# EAGLE design Character ID Receiver I2C xbee (EAGLE 6.4)
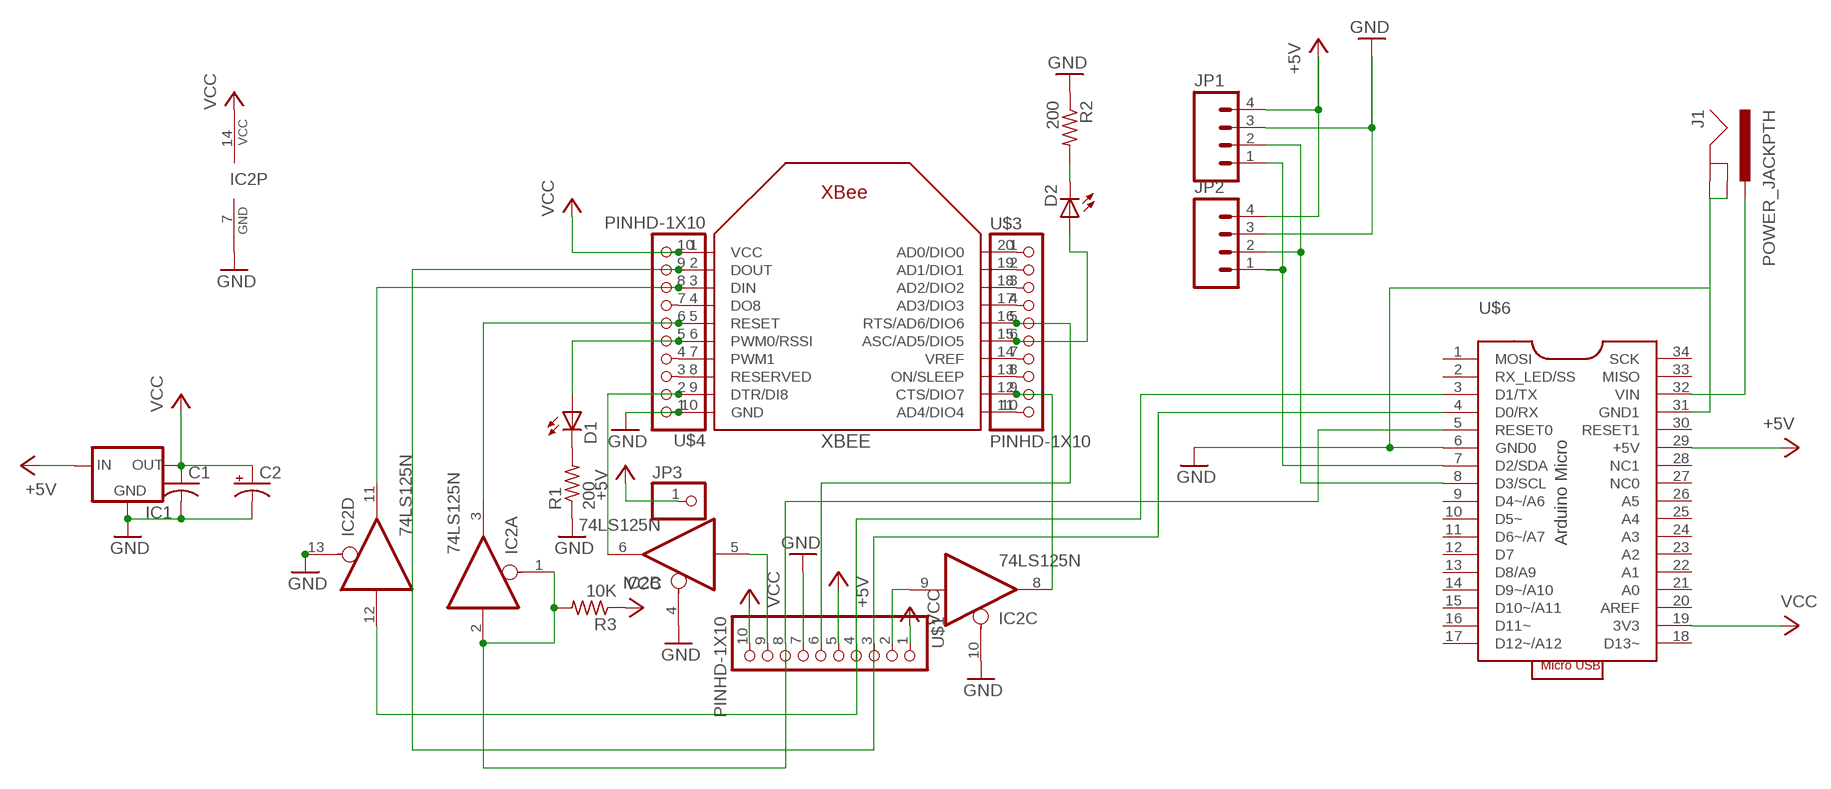
[diagram p0: schematic, sheet 1]

## Parts
C1  C-US025-025X050  [C025-025X050]
C2  CPOL-USE2.5-5  [E2,5-5]
D1  LED3MM  [LED3MM]
D2  LED3MM  [LED3MM]
IC1  MC1700  [TO92]
IC2  74LS125N  [DIL14]
J1  POWER_JACKPTH  [POWER_JACK_PTH]
JP1  M041X04_NO_SILK  [1X04_NO_SILK]
JP2  M041X04_NO_SILK  [1X04_NO_SILK]
JP3  PINHD-1X1  [1X01]
R1  200  R-US_0207/10  [0207/10]
R2  200  R-US_0207/10  [0207/10]
R3  10K  R-US_0207/10  [0207/10]
U$1  PINHD-1X10  [1X10-BIG]
U$3  PINHD-1X10  [1X10-BIG]
U$4  PINHD-1X10  [1X10-BIG]
U$6  ARDUINO-MICRO  [ARDUINO-MICRO-DIP34]
XBEE  XBEE  [XBEE]

## Nets
+5V: IC1.2(IN) JP1.4 JP2.4 JP3.1 U$1.5 U$6.29(+5V)
GND: C1.2 C2.- IC1.1(GND) IC2.4(B:OE) IC2.7(P:GND) IC2.10(C:OE) IC2.13(D:OE) J1.GND J1.GNDBREAK JP1.3 JP2.3 R1.1 R2.1 U$1.7 U$4.1 U$6.6(GND0) U$6.31(GND1) XBEE.10(GND)
N$1: IC2.12(D:I) U$1.4 U$6.3(D1/TX)
N$2: IC2.11(D:O) U$4.8 XBEE.3(DIN)
N$3: IC2.5(B:I) U$1.9
N$4: IC2.8(C:O) U$3.9 XBEE.12(CTS/DIO7)
N$5: D2.K(C) R2.2
N$6: U$4.7 XBEE.4(DO8)
N$7: D1.A U$4.5 XBEE.6(PWM0/RSSI)
N$8: D1.K(C) R1.2
N$9: D2.A U$3.6 XBEE.15(ASC/AD5/DIO5)
N$10: IC2.6(B:O) U$4.2 XBEE.9(DTR/DI8)
N$11: U$4.3 XBEE.8(RESERVED)
N$12: U$4.4 XBEE.7(PWM1)
N$13: IC2.3(A:O) U$4.6 XBEE.5(RESET)
N$14: U$3.1 XBEE.20(AD0/DIO0)
N$15: U$3.2 XBEE.19(AD1/DIO1)
N$16: U$3.3 XBEE.18(AD2/DIO2)
N$17: U$3.4 XBEE.17(AD3/DIO3)
N$18: U$3.7 XBEE.14(VREF)
N$19: U$3.8 XBEE.13(ON/SLEEP)
N$20: U$3.10 XBEE.11(AD4/DIO4)
N$21: IC2.9(C:I) U$1.2
N$22: JP1.2 JP2.2 U$6.8(D3/SCL)
N$23: JP1.1 JP2.1 U$6.7(D2/SDA)
N$24: J1.PWR U$6.32(VIN)
RESET: IC2.1(A:OE) IC2.2(A:I) R3.2 U$1.8 U$6.5(RESET0)
RTS: U$1.6 U$3.5 XBEE.16(RTS/AD6/DIO6)
TX: U$1.3 U$4.9 U$6.4(D0/RX) XBEE.2(DOUT)
VCC: C1.1 C2.+ IC1.3(OUT) IC2.14(P:VCC) R3.1 U$1.1 U$1.10 U$4.10 U$6.19(3V3) XBEE.1(VCC)
Unconnected: U$6.1(MOSI) U$6.2(RX_LED/SS) U$6.9(D4~/A6) U$6.10(D5~) U$6.11(D6~/A7) U$6.12(D7) U$6.13(D8/A9) U$6.14(D9~/A10) U$6.15(D10~/A11) U$6.16(D11~) U$6.17(D12~/A12) U$6.18(D13~) U$6.20(AREF) U$6.21(A0) U$6.22(A1) U$6.23(A2) U$6.24(A3) U$6.25(A4) U$6.26(A5) U$6.27(NC0) U$6.28(NC1) U$6.30(RESET1) U$6.33(MISO) U$6.34(SCK)

## Library data of the parts
C1 = rcl-ez:C-US: CAPACITOR, American symbol
C2 = rcl-ez:CPOL-US: POLARIZED CAPACITOR, American symbol
D1 D2 = minimidi:LED: LED OSRAM: - CHIPLED LG R971, LG N971, LY N971, LG Q971, LY Q971, LO R971, LY R971 LH N974, LH R974 LS Q976, LO Q976, LY Q976 LO Q996 - Hyper CHIPLED LW Q18S LB Q993, LB Q99A, LB R99A - SideLED LS A670, LO A670, LY A670, LG A670, LP A670 LB A673, LV A673, LT A673, LW A673 LH A674 LY A675 LS A676, LA A676, LO A676, LY A676, LW A676 LS A679, LY A679, LG A679 - Hyper Micro SIDELED® LS Y876, LA Y876, LO Y876, LY Y876 LT Y87S - SmartLED LW L88C, LW L88S LB L89C, LB L89S, LG L890 LS L89K, LO L89K, LY L89K LS L896, LA L896, LO L896, LY L896 - TOPLED LS T670, LO T670, LY T670, LG T670, LP T670 LSG T670, LSP T670, LSY T670, LOP T670, LYG T670 LG T671, LOG T671, LSG T671 LB T673, LV T673, LT T673, LW T673 LH T674 LS T676, LA T676, LO T676, LY T676, LB T676, LH T676, LSB T676, LW T676 LB T67C, LV T67C, LT T67C, LS T67K, LO T67K, LY T67K, LW E67C LS E67B, LA E67B, LO E67B, LY E67B, LB E67C, LV E67C, LT E67C LW T67C LS T679, LY T679, LG T679 LS T770, LO T770, LY T770, LG T770, LP T770 LB T773, LV T773, LT T773, LW T773 LH T774 LS E675, LA E675, LY E675, LS T675 LS T776, LA T776, LO T776, LY T776, LB T776 LHGB T686 LT T68C, LB T68C - Hyper Mini TOPLED® LB M676 - Mini TOPLED Santana® LG M470 LS M47K, LO M47K, LY M47K Source: http://www.osram.convergy.de/
IC1 = ulink:MC1700: VOLTAGE REGULATOR
IC2 = 74xx-us:74*125: Quad bus BUFFER, 3-state
J1 = SparkFun-Connectors:POWER_JACK: Power Jack This is the standard 5.5mm barrel jack for power. The PTH is the most common, proven, reliable, footprint. All others are experimental. The Slot footprint only works if the mill layer is transmitted to the PCB fab house so be warned. Spark Fun Electronics SKU : PRT-00119. Mating wall wart : TOL-00298 (and others)
JP1 JP2 = SparkFun-Connectors:M04: Header 4 Standard 4-pin 0.1" header. Use with straight break away headers (SKU : PRT-00116), right angle break away headers (PRT-00553), swiss pins (PRT-00743), machine pins (PRT-00117), and female headers (PRT-00115). Molex polarized connector foot print use with SKU : PRT-08231 with associated crimp pins and housings. 1MM SMD Version SKU: PRT-10208
JP3 = digg:PINHD-1X1: PIN HEADER
R1-R3 = rcl-ez:R-US_: RESISTOR, American symbol
U$1 U$3 U$4 = ybox2:PINHD-1X10
U$6 = rseries:ARDUINO-MICRO
XBEE = ulink:XBEE

## Board
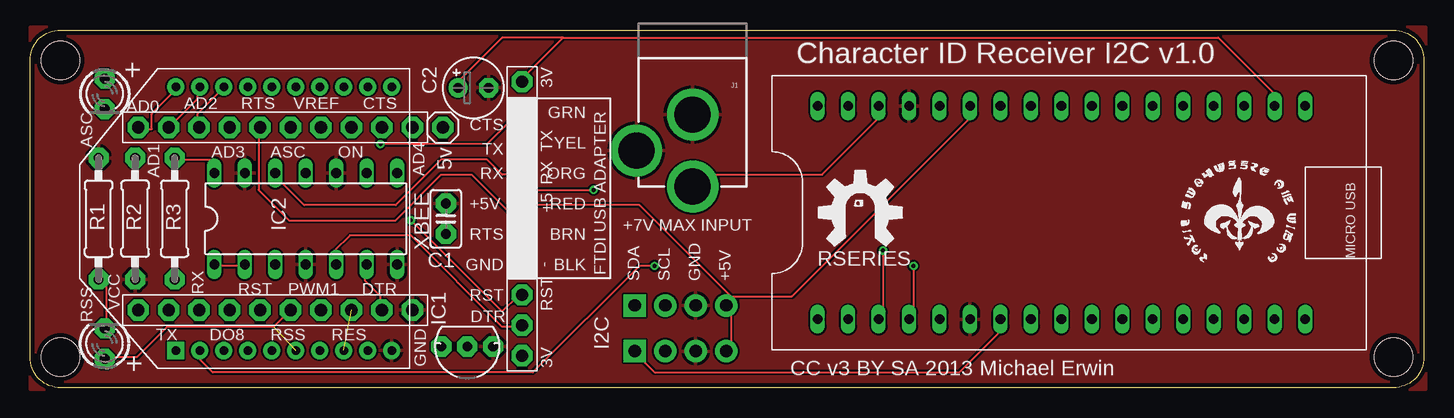
[diagram p1: board, top side]
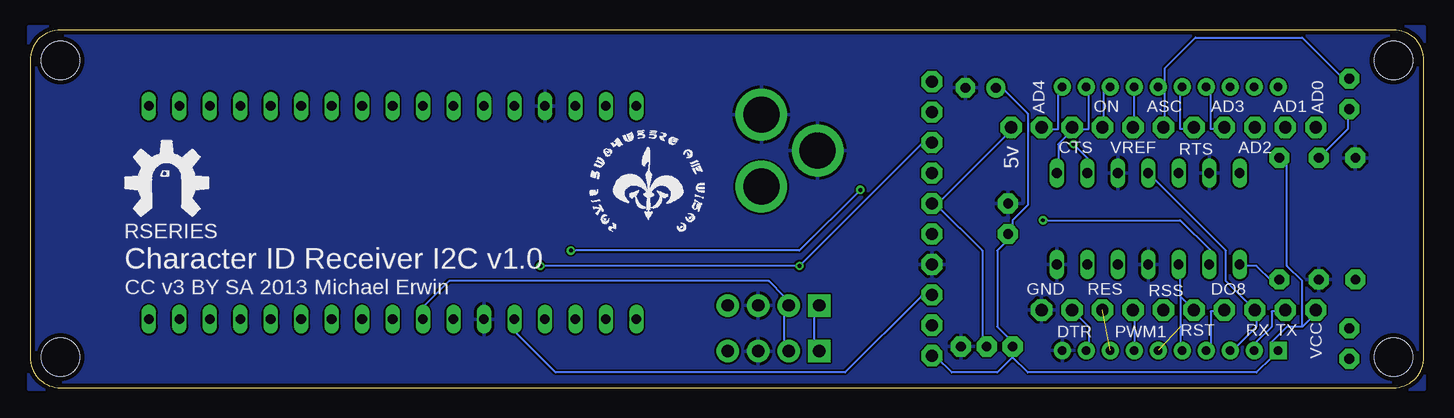
[diagram p2: board, bottom side, seen from below]

Size 116.2 x 29.84 mm. Coordinates in mm from the lower left corner, seen from the top.
Outline: 5.71,29.84 113.67,29.84 arc-90 116.2,27.3 116.2,2.54 arc-90 113.67,0 2.54,0 arc-90 0,2.54 0,27.3 arc-90 2.54,29.84 5.71,29.84
Copper layers (1*16): Top 0.0356mm / dielectric 1.5011mm / Bottom 0.0356mm
Design rules "LaenPCBOrder": minimum track width 6mil, minimum drill 13mil, track to track 6mil, track to pad 6mil, pad to pad 6mil, via to via 6mil, smd to smd 6mil, copper to edge 15mil, drill to drill 6mil, minimum pad ring 7mil, minimum via ring 7mil, stop-mask expansion 4mil, vias tented up to drill 0mil, thermal gap 10mil
Holes 3.2 mm at 2.54,2.54 2.54,27.3 113.67,27.3 113.67,2.54

### Footprints (pad centres in the part's own frame; a part is rotated, then mirrored left to right if it is on the bottom)
C025-025X050 = drill 0.813 pad 1.676 octagon: 1 -1.27,0; 2 1.27,0
E2,5-5 = drill 0.813 pad 1.6: + -1.27,0 | drill 0.813 pad 1.6 octagon: - 1.27,0
LED3MM = drill 0.813 pad 1.676 octagon: A -1.27,0; K 1.27,0
TO92 = drill 0.813 pad 1.676 octagon: 1 -2.159,0; 2 0,0; 3 2.159,0
DIL14 = drill 0.813 long: 1 -7.62,-3.81; 2 -5.08,-3.81; 3 -2.54,-3.81; 4 0,-3.81; 5 2.54,-3.81; 6 5.08,-3.81; 7 7.62,-3.81; 8 7.62,3.81; 9 5.08,3.81; 10 2.54,3.81; 11 0,3.81; 12 -2.54,3.81; 13 -5.08,3.81; 14 -7.62,3.81
POWER_JACK_PTH = drill 2.997 pad 4.318: GND 0,7.7; GNDBREAK 4.7,10.7; PWR 0,13.7
1X04_NO_SILK = drill 1.016 pad 1.88 square: 1 0,0 | drill 1.016 pad 1.88: 2 2.54,0; 3 5.08,0; 4 7.62,0
1X01 = drill 1.016 pad 1.778 octagon: 1 0,0
0207/10 = drill 0.813 pad 1.676 octagon: 1 -5.08,0; 2 5.08,0
1X10-BIG = drill 1.016 pad 1.778 octagon: 1 -11.43,0; 2 -8.89,0; 3 -6.35,0; 4 -3.81,0; 5 -1.27,0; 6 1.27,0; 7 3.81,0; 8 6.35,0; 9 8.89,0; 10 11.43,0
ARDUINO-MICRO-DIP34 = drill 0.8 long: 1 -8.89,19.05; 2 -8.89,16.51; 3 -8.89,13.97; 4 -8.89,11.43; 5 -8.89,8.89; 6 -8.89,6.35; 7 -8.89,3.81; 8 -8.89,1.27; 9 -8.89,-1.27; 10 -8.89,-3.81; 11 -8.89,-6.35; 12 -8.89,-8.89; 13 -8.89,-11.43; 14 -8.89,-13.97; 15 -8.89,-16.51; 16 -8.89,-19.05; 17 -8.89,-21.59; 18 8.89,-21.59; 19 8.89,-19.05; 20 8.89,-16.51; 21 8.89,-13.97; 22 8.89,-11.43; 23 8.89,-8.89; 24 8.89,-6.35; 25 8.89,-3.81; 26 8.89,-1.27; 27 8.89,1.27; 28 8.89,3.81; 29 8.89,6.35; 30 8.89,8.89; 31 8.89,11.43; 32 8.89,13.97; 33 8.89,16.51; 34 8.89,19.05
XBEE = drill 0.7 pad 1.422 square: 1 -11,5.5 | drill 0.7 pad 1.422: 2 -11,3.5; 3 -11,1.5; 4 -11,-0.5; 5 -11,-2.5; 6 -11,-4.5; 7 -11,-6.5; 8 -11,-8.5; 9 -11,-10.5; 10 -11,-12.5; 11 11,-12.5; 12 11,-10.5; 13 11,-8.5; 14 11,-6.5; 15 11,-4.5; 16 11,-2.5; 17 11,-0.5; 18 11,1.5; 19 11,3.5; 20 11,5.5

### Placement (x,y rotation side)
C1  34.67,14.1 90 top
C2  36.96,25.02 0 top
D1  6.22,3.68 90 top
D2  6.22,24.51 270 top
IC1  36.45,3.43 180 top
IC2  22.99,14.1 0 top
J1  55.24,30.48 180 top
JP1  50.42,3.05 0 top
JP2  50.42,6.86 0 top
JP3  34.42,21.72 90 top
R1  5.71,14.1 270 top
R2  8.76,14.1 90 top
R3  12.06,14.1 270 top
U$1  41.02,14.1 270 top
U$2  [RSERIES-OSHW-LOGO-LARGE]  104.8,17.09 0 bottom
U$3  20.45,21.72 0 top
U$4  20.45,6.48 180 top
U$5  [ROYAL-ENGINEERS-OF-NABOO-SMALL]  69.6,12.7 0 bottom
U$6  84.71,14.61 90 top
U$7  [ROYAL-ENGINEERS-OF-NABOO-SMALL]  95.89,10.16 0 top
U$8  [RSERIES-OSHW-LOGO-LARGE]  69.22,14.61 0 top
XBEE  17.65,14.1 90 top

### Tracks (layer width: path | path; a pad name or v marks a point on that pad's centre or on a via)
+5V
  Top 0.152: 58.42,7.62 63.5,7.62 78.74,22.86 U$6.29 | 58.42,7.62 JP2.4 | JP1.4 58.42,3.81 58.42,6.35 JP2.4 | 58.42,7.62 50.8,15.24 40.64,15.24 U$1.5 | 58.42,7.62 JP2.4
  Bottom 0.152: 40.64,15.24 36.83,11.43 36.83,3.81 IC1.2 | 40.64,15.24 U$1.5 40.64,15.24 | 40.64,15.24 34.29,21.59 JP3.1
GND
  pour Bottom: -0.03,30.1 116.31,30.1 116.31,-0.13 -0.03,-0.13
  pour Top: 0,30.07 116.36,30.07 116.36,-0.13 0,-0.13
N$1  (via drill 0.33)
  Top 0.152: v71.12,11.43 71.12,6.35 U$6.3 | v46.99,16.51 41.91,16.51 40.64,17.78 | 40.64,17.78 U$1.4 40.64,17.78 | 40.64,17.78 39.37,17.78 38.1,19.05 34.29,19.05 30.48,15.24 22.86,15.24 20.32,17.78 IC2.12
  Bottom 0.152: v71.12,11.43 52.07,11.43 v46.99,16.51
N$2
  Bottom 0.152: 13.97,6.35 U$4.8 | U$4.8 16.51,8.89 16.51,11.43 22.86,17.78 IC2.11 | 13.97,6.35 U$4.8 | 13.97,6.35 13.97,5.08 16.51,2.54 XBEE.3 | 13.97,6.35 U$4.8
N$3
  Top 0.152: IC2.5 25.4,11.43 26.67,12.7 31.75,12.7 39.37,5.08 40.64,5.08 U$1.9
N$4
  Bottom 0.152: 29.21,21.59 30.48,20.32 30.48,19.05 IC2.8 | 29.21,21.59 U$3.9 29.21,21.59 | 29.21,21.59 27.94,21.59 27.94,25.4 XBEE.12
N$5
  Bottom 0.152: R2.2 6.35,21.59 6.35,22.86 D2.K | R2.2 8.89,19.05 R2.2
N$6
  Bottom 0.152: XBEE.4 17.78,2.54 17.78,6.35 16.51,6.35 U$4.7
N$7  (1 unrouted)
  Top 0.152: D1.A 6.35,2.54 8.89,2.54 11.43,5.08 20.32,5.08 21.59,6.35 U$4.5
N$8
  Top 0.152: D1.K 6.35,5.08 6.35,8.89 R1.2
N$9
  Bottom 0.152: 21.59,25.4 21.59,21.59 U$3.6 | 21.59,25.4 XBEE.15 21.59,25.4 | 21.59,25.4 21.59,26.67 19.05,29.21 10.16,29.21 6.35,25.4 D2.A
N$10
  Top 0.152: IC2.6 27.94,10.16 27.94,8.89 29.21,7.62 29.21,6.35 U$4.2
  Bottom 0.152: XBEE.9 27.94,2.54 27.94,5.08 29.21,6.35 U$4.2
N$11  (1 unrouted)
N$12
  Bottom 0.152: XBEE.7 24.13,2.54 24.13,6.35 U$4.4
N$13
  Bottom 0.152: 20.32,7.62 20.32,10.16 IC2.3 | U$4.6 19.05,6.35 U$4.6 | U$4.6 20.32,7.62 | 20.32,7.62 20.32,2.54 XBEE.5
N$14
  Top 0.152: XBEE.20 12.7,25.4 10.16,22.86 10.16,21.59 8.89,21.59 U$3.1
N$15
  Top 0.152: U$3.2 11.43,21.59 U$3.2 | U$3.2 13.97,24.13 13.97,25.4 XBEE.19
N$16
  Top 0.152: XBEE.18 16.51,25.4 13.97,22.86 13.97,21.59 U$3.3
N$17
  Bottom 0.152: XBEE.17 17.78,25.4 17.78,21.59 16.51,21.59 U$3.4
N$18
  Bottom 0.152: XBEE.14 24.13,25.4 24.13,21.59 U$3.7
N$19
  Bottom 0.152: XBEE.13 26.67,25.4 26.67,21.59 U$3.8
N$20
  Bottom 0.152: XBEE.11 30.48,25.4 30.48,21.59 31.75,21.59 U$3.10
N$21  (via drill 0.33)
  Top 0.152: v29.21,20.32 38.1,20.32 40.64,22.86 U$1.2
  Bottom 0.152: v29.21,20.32 27.94,19.05 IC2.9
N$22
  Bottom 0.152: U$6.8 83.82,6.35 81.28,8.89 54.61,8.89 53.34,7.62 JP2.2 53.34,6.35 53.34,3.81 JP1.2
N$23
  Top 0.152: U$6.7 81.28,5.08 77.47,1.27 52.07,1.27 50.8,2.54 JP1.1
  Bottom 0.152: JP2.1 50.8,6.35 50.8,3.81 JP1.1
N$24
  Top 0.152: U$6.32 71.12,22.86 66.04,17.78 55.88,17.78 J1.PWR
RESET  (via drill 0.33)
  Top 0.152: IC2.1 15.24,10.16 17.78,10.16 IC2.2 | v31.75,13.97 39.37,6.35 40.64,7.62 U$1.8
  Bottom 0.152: IC2.1 15.24,10.16 13.97,10.16 12.7,8.89 R3.2 | U$6.5 76.2,5.08 72.39,1.27 48.26,1.27 41.91,7.62 40.64,7.62 U$1.8 | v31.75,13.97 20.32,13.97 17.78,11.43 IC2.2
RTS
  Top 0.152: U$1.6 40.64,12.7 40.64,13.97 36.83,17.78 34.29,17.78 30.48,13.97 21.59,13.97 19.05,16.51 19.05,21.59 U$3.5
  Bottom 0.152: XBEE.16 20.32,25.4 20.32,21.59 19.05,21.59 U$3.5
TX  (via drill 0.33)
  Top 0.152: v73.66,10.16 73.66,6.35 U$6.4 | v52.07,10.16 50.8,10.16 41.91,1.27 15.24,1.27 13.97,2.54 XBEE.2
  Bottom 0.152: XBEE.2 13.97,2.54 13.97,3.81 12.7,5.08 12.7,6.35 11.43,6.35 U$4.9 | v73.66,10.16 v52.07,10.16 41.91,20.32 40.64,20.32 U$1.3
VCC
  Top 0.152: IC2.14 15.24,19.05 12.7,19.05 R3.1 | 44.45,29.21 99.06,29.21 104.14,24.13 U$6.19 | 44.45,29.21 40.64,25.4 U$1.1 | 44.45,29.21 39.37,29.21 35.56,25.4 C2.+
  Bottom 0.152: 34.29,3.81 35.56,5.08 35.56,11.43 34.29,12.7 | 34.29,3.81 IC1.3 | 34.29,12.7 C1.1 34.29,12.7 | 34.29,2.54 35.56,1.27 39.37,1.27 40.64,2.54 U$1.10 | 34.29,3.81 IC1.3 | IC1.3 34.29,2.54 | 34.29,3.81 IC1.3 | 12.7,2.54 12.7,3.81 11.43,5.08 10.16,5.08 | 10.16,5.08 8.89,6.35 U$4.10 | 12.7,2.54 XBEE.1 12.7,2.54 | 10.16,5.08 10.16,8.89 11.43,10.16 11.43,19.05 R3.1 | 34.29,2.54 33.02,1.27 13.97,1.27 12.7,2.54 | 34.29,12.7 34.29,13.97 33.02,15.24 33.02,22.86 35.56,25.4 C2.+

### Text on the board
tPlace: Character ID Receiver I2C v1.0 | 3V | GRN | YEL | TX | RX | ORG | +5V | RED | RTS | BRN | +7V MAX INPUT | GND | BLK | MICRO USB | RSERIES | FTDI USB ADAPTER | SDA | SCL | GND | +5V | RST | DTR | I2C | 3V | CC v3 BY SA 2013 Michael Erwin
bPlace: RSERIES | Character ID Receiver I2C v1.0 | CC v3 BY SA 2013 Michael Erwin
tNames: + | AD0 | AD2 | RTS | VREF | CTS | ASC | CTS | AD1 | AD3 | ASC | ON | TX | RX | AD4 | 5v | +5 | RX | - | RST | PWM1 | DTR | RST | VCC | RSS | TX | DO8 | RSS | RES | GND | +
bNames: AD0 | AD1 | AD3 | ASC | ON | AD4 | AD2 | VREF | CTS | 5v | RTS | DO8 | RSS | RES | GND | TX | RX | RST | PWM1 | DTR | VCC